# Altium schematic sheet esame1207schematico.SchDoc
size A4; SheetNumber: 1; SheetTotal: 1; SPICEModelCacheCVDAFJRX: <root> / <DocumentId>CVDAFJRX</DocumentId> / <CacheFrame Number="0"> / <Model Name="cap" Kind="MDL"> / <Text>*Default semiconductor capacitor / .MODEL CAP C()</Text> / </Model> / </CacheFrame> / </root>
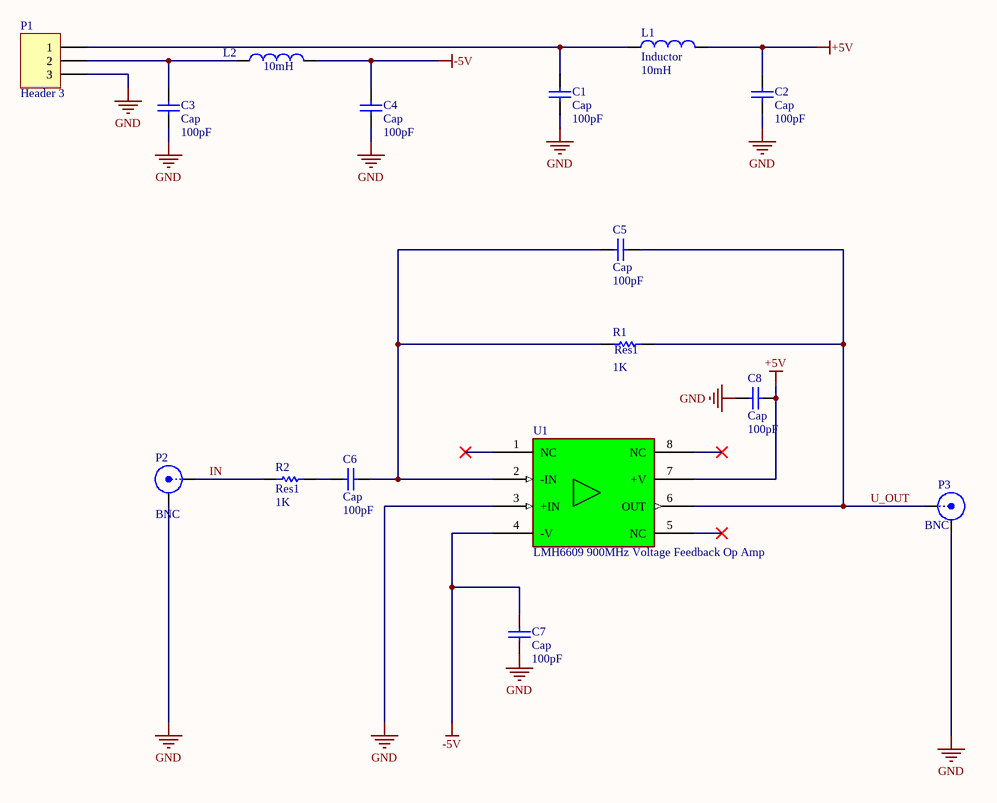
[diagram p0: esame1207schematico.SchDoc]

## Parts
C1  Cap  value 100pF  [0603 Comp]
C2  Cap  value 100pF  [0603 Comp]
C3  Cap  value 100pF  [0603 Comp]
C4  Cap  value 100pF  [0603 Comp]
C5  Cap  value 100pF  [0603 Comp]
C6  Cap  value 100pF  [0603 Comp]
C7  Cap  value 100pF  [0603 Comp]
C8  Cap  value 100pF  [0603 Comp]
L1  Inductor  value 10mH  [0603 Comp]
L2  value 10mH  [0603 Comp]  (hidden comment: Inductor)
P1  Header 3  [HDR1X3]
P2  BNC  [SMB_V-RJ45]
P3  BNC  [SMB_V-RJ45]
R1  Res1  value 1K  [0603 Comp]
R2  Res1  value 1K  [0603 Comp]
U1  LMH6609 900MHz Voltage Feedback Op Amp  [SOIC]

## Nets
+5V: C2.2 C8.1 L1.2 U1.7(+V)
-5V: C4.2 C7.2 L2.2 U1.4(-V)
GND: C1.1 C2.1 C3.1 C4.1 C7.1 C8.2 P1.3 P2.2(Y) P3.2(Y) U1.3(+IN)
IN: P2.1(X) R2.2
U_OUT: C5.2 P3.1(X) R1.2 U1.6(OUT)
NetC1_2: C1.2 L1.1 P1.1
NetC3_2: C3.2 L2.1 P1.2
NetC5_1: C5.1 C6.2 R1.1 U1.2(-IN)
NetC6_1: C6.1 R2.1

Not connected (* = marked no-connect by the designer): U1 1(NC)* 5(NC)* 8(NC)*

## Library data of the parts
C1-C8 = Cap: Capacitor; Published: 8-Jun-2000; LatestRevisionDate: 17-Jul-2002; LatestRevisionNote: Re-released for DXP Platform.; PackageReference: RAD-0.3; Publisher: Altium Limited; PackageDescription: Radial Cap, Thru-Hole; 2 Leads; 0.3 in Pin Spacing
L1 L2 = Inductor: Code_IEC: 1005; Published: 8-Jun-2000; LatestRevisionDate: 29-May-2009; LatestRevisionNote: IPC-7351 Footprint Added.; PackageReference: 0402-A; Publisher: Altium Limited; PackageDescription: Chip Inductor; Code_JEITA: 0402
P1 = Header 3: Header, 3-Pin; LatestRevisionDate: 17-Jul-2002; LatestRevisionNote: Re-released for DXP Platform.; Publisher: Altium Limited
P2 P3 = BNC: BNC Elbow Connector; LatestRevisionDate: 17-Jul-2002; LatestRevisionNote: Re-released for DXP Platform.; Publisher: Altium Limited
R1 R2 = Res1: Resistor; Published: 8-Jun-2000; LatestRevisionDate: 17-Jul-2002; LatestRevisionNote: Re-released for DXP Platform.; PackageReference: AXIAL-0.3; Publisher: Altium Limited; PackageDescription: Axial Device, Thru-Hole; 2 Leads; 0.3 in Pin Spacing
U1 = LMA6609